# EAGLE design Spannungsversorgung (EAGLE 9.6.2)

## Sheet 1 of 3: In- & Outputs
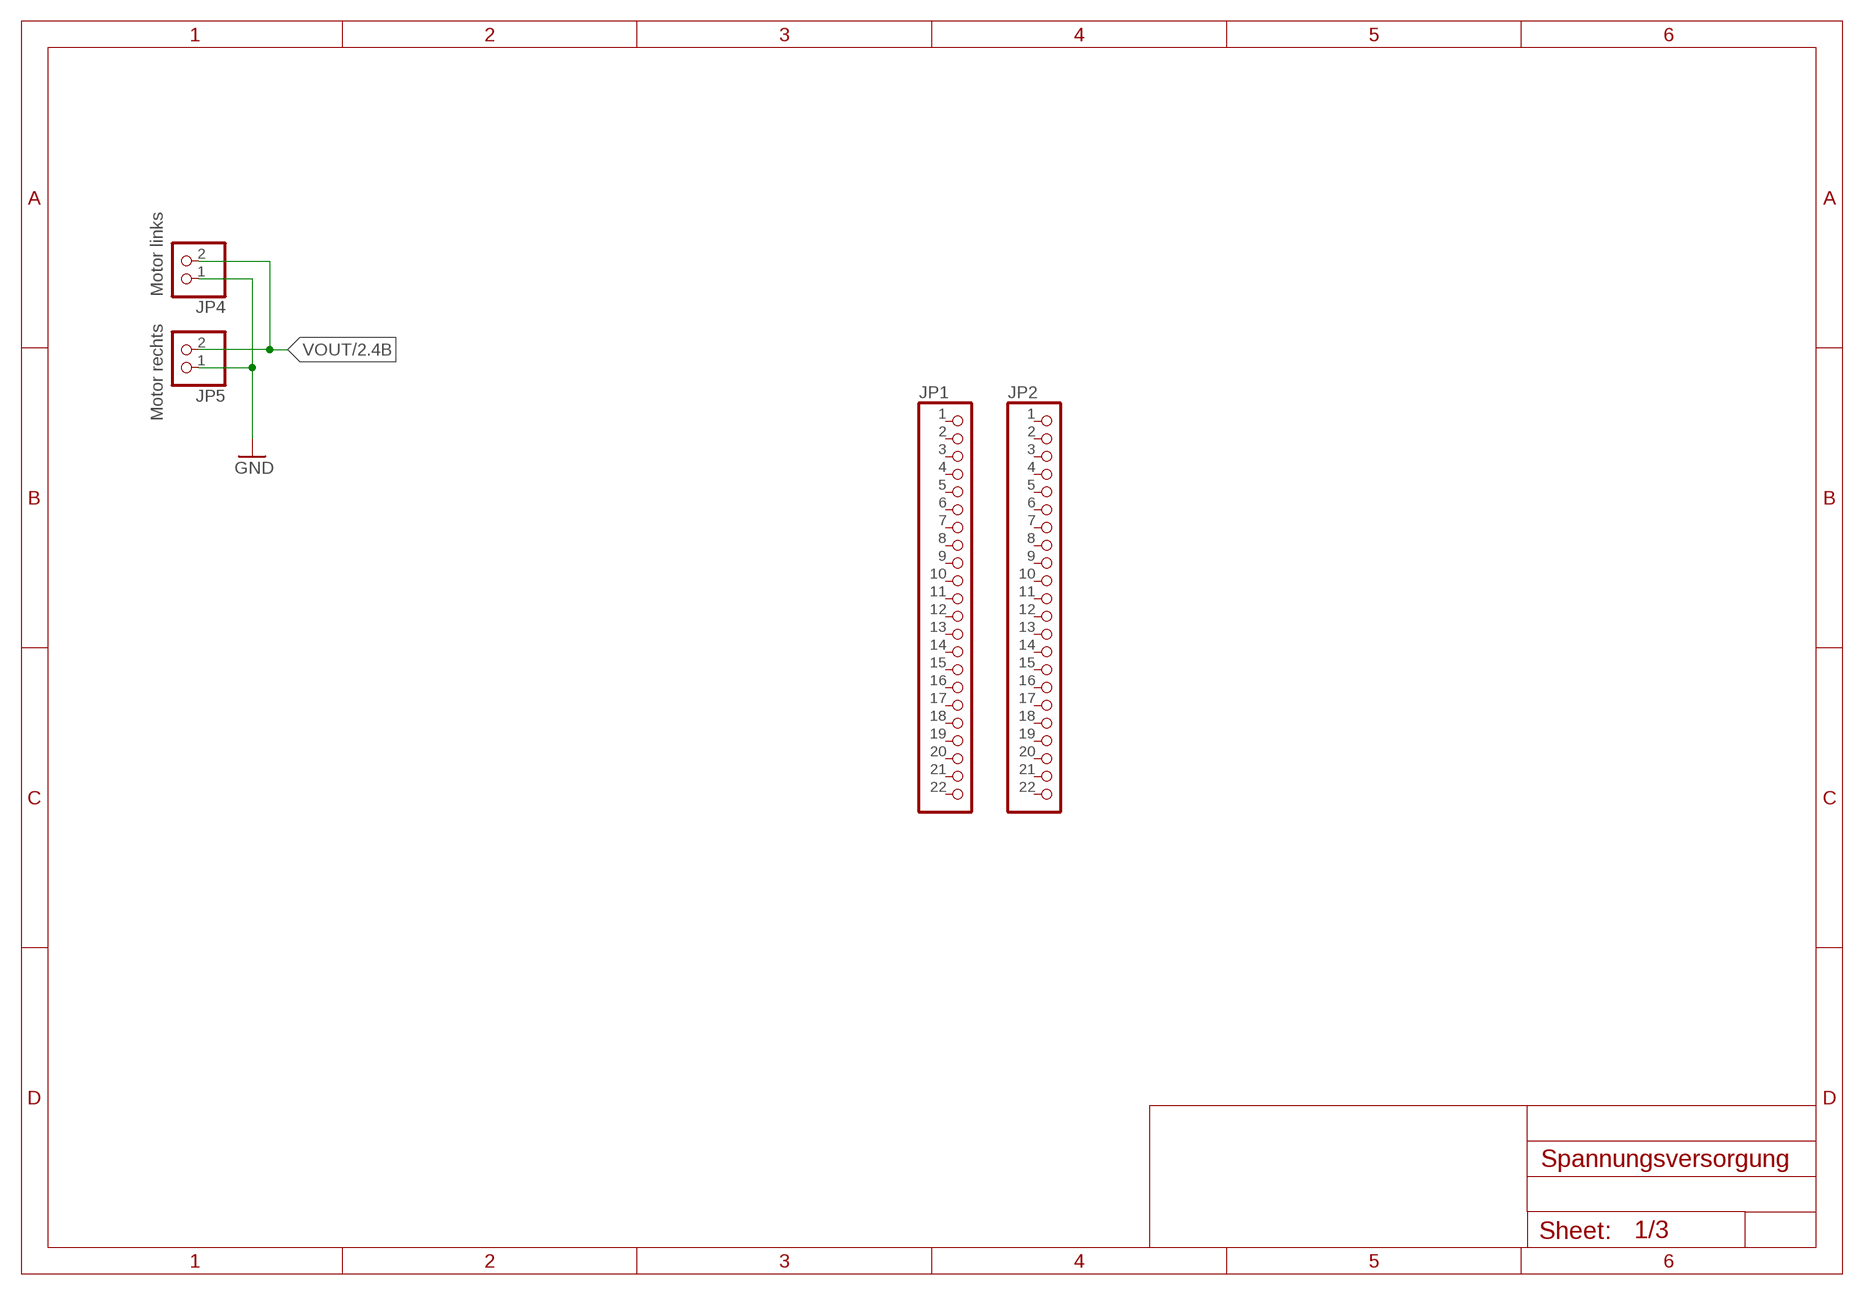
[diagram p0: schematic, sheet 1]

### Parts
JP1  PINHD-1X22  [1X22]
JP2  PINHD-1X22  [1X22]
JP4  PINHD-1X2  [1X02]
JP5  PINHD-1X2  [1X02]

### Nets
GND: JP4.1 JP5.1 ; also sheet 2
VOUT: JP4.2 JP5.2 ; also sheet 2
Unconnected: JP1.1 JP1.2 JP1.3 JP1.4 JP1.5 JP1.6 JP1.7 JP1.8 JP1.9 JP1.10 JP1.11 JP1.12 JP1.13 JP1.14 JP1.15 JP1.16 JP1.17 JP1.18 JP1.19 JP1.20 JP1.21 JP1.22 JP2.1 JP2.2 JP2.3 JP2.4 JP2.5 JP2.6 JP2.7 JP2.8 JP2.9 JP2.10 JP2.11 JP2.12 JP2.13 JP2.14 JP2.15 JP2.16 JP2.17 JP2.18 JP2.19 JP2.20 JP2.21 JP2.22

### Notes on the sheet
- Motor links
- Motor rechts

## Sheet 2 of 3: Spannungsregler
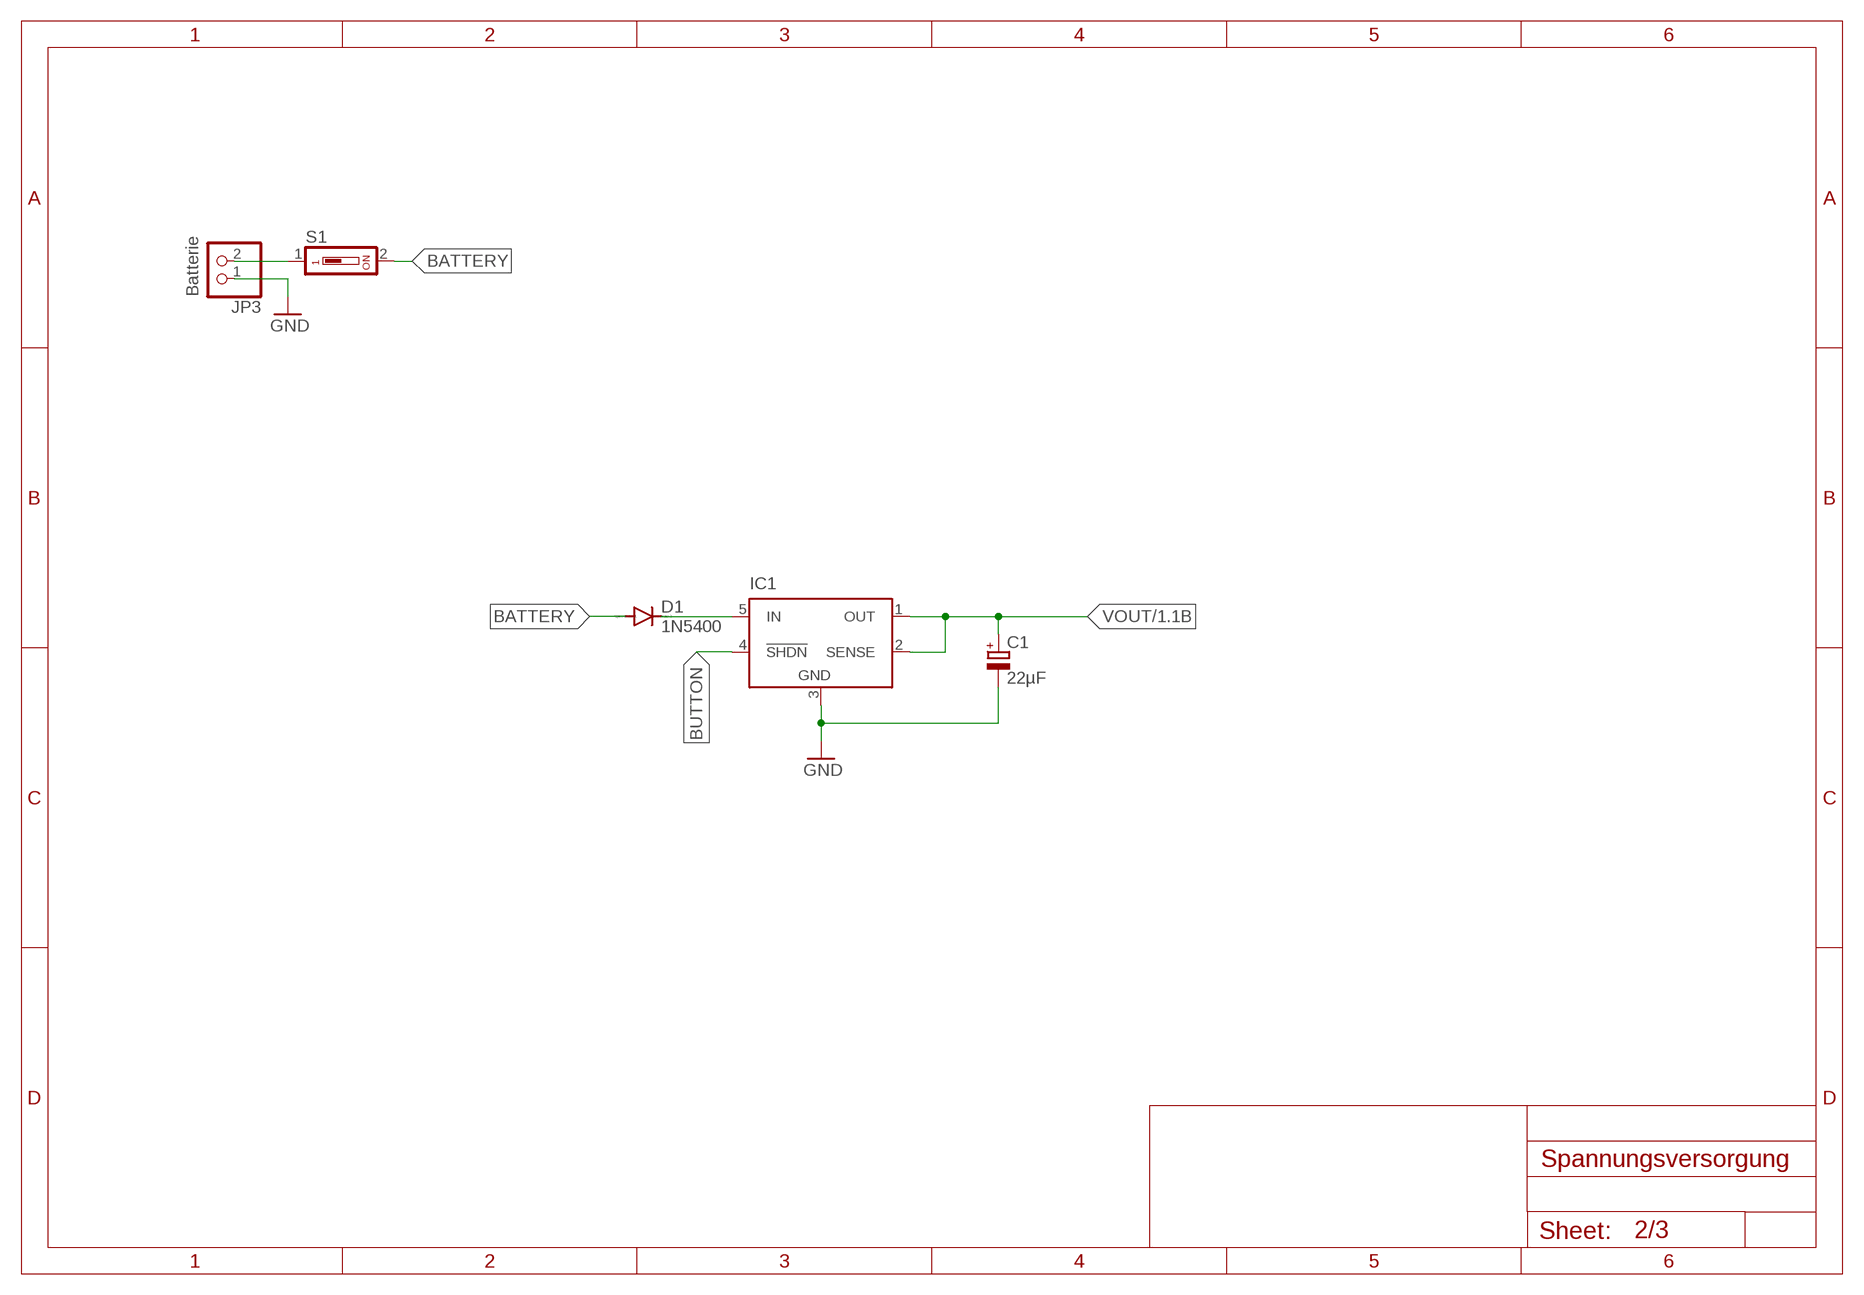
[diagram p1: schematic, sheet 2]

### Parts
C1  22µF  CPOL-EUE2.5-5  [E2,5-5]
D1  1N5400  [DO201-15]
IC1  LT1529T  [TO220-5]
JP3  PINHD-1X2  [1X02]
S1  DS01  [DS-01]

### Nets
BATTERY: D1.A JP3.2 S1.1 S1.2
BUTTON: IC1.4(!SHDN)
GND: C1.- IC1.3(GND) JP3.1 ; also sheet 1
N$2: D1.C IC1.5(IN)
VOUT: C1.+ IC1.1(OUT) IC1.2(SENSE) ; also sheet 1

### Notes on the sheet
- Batterie

## Sheet 3 of 3: Verschiedenes
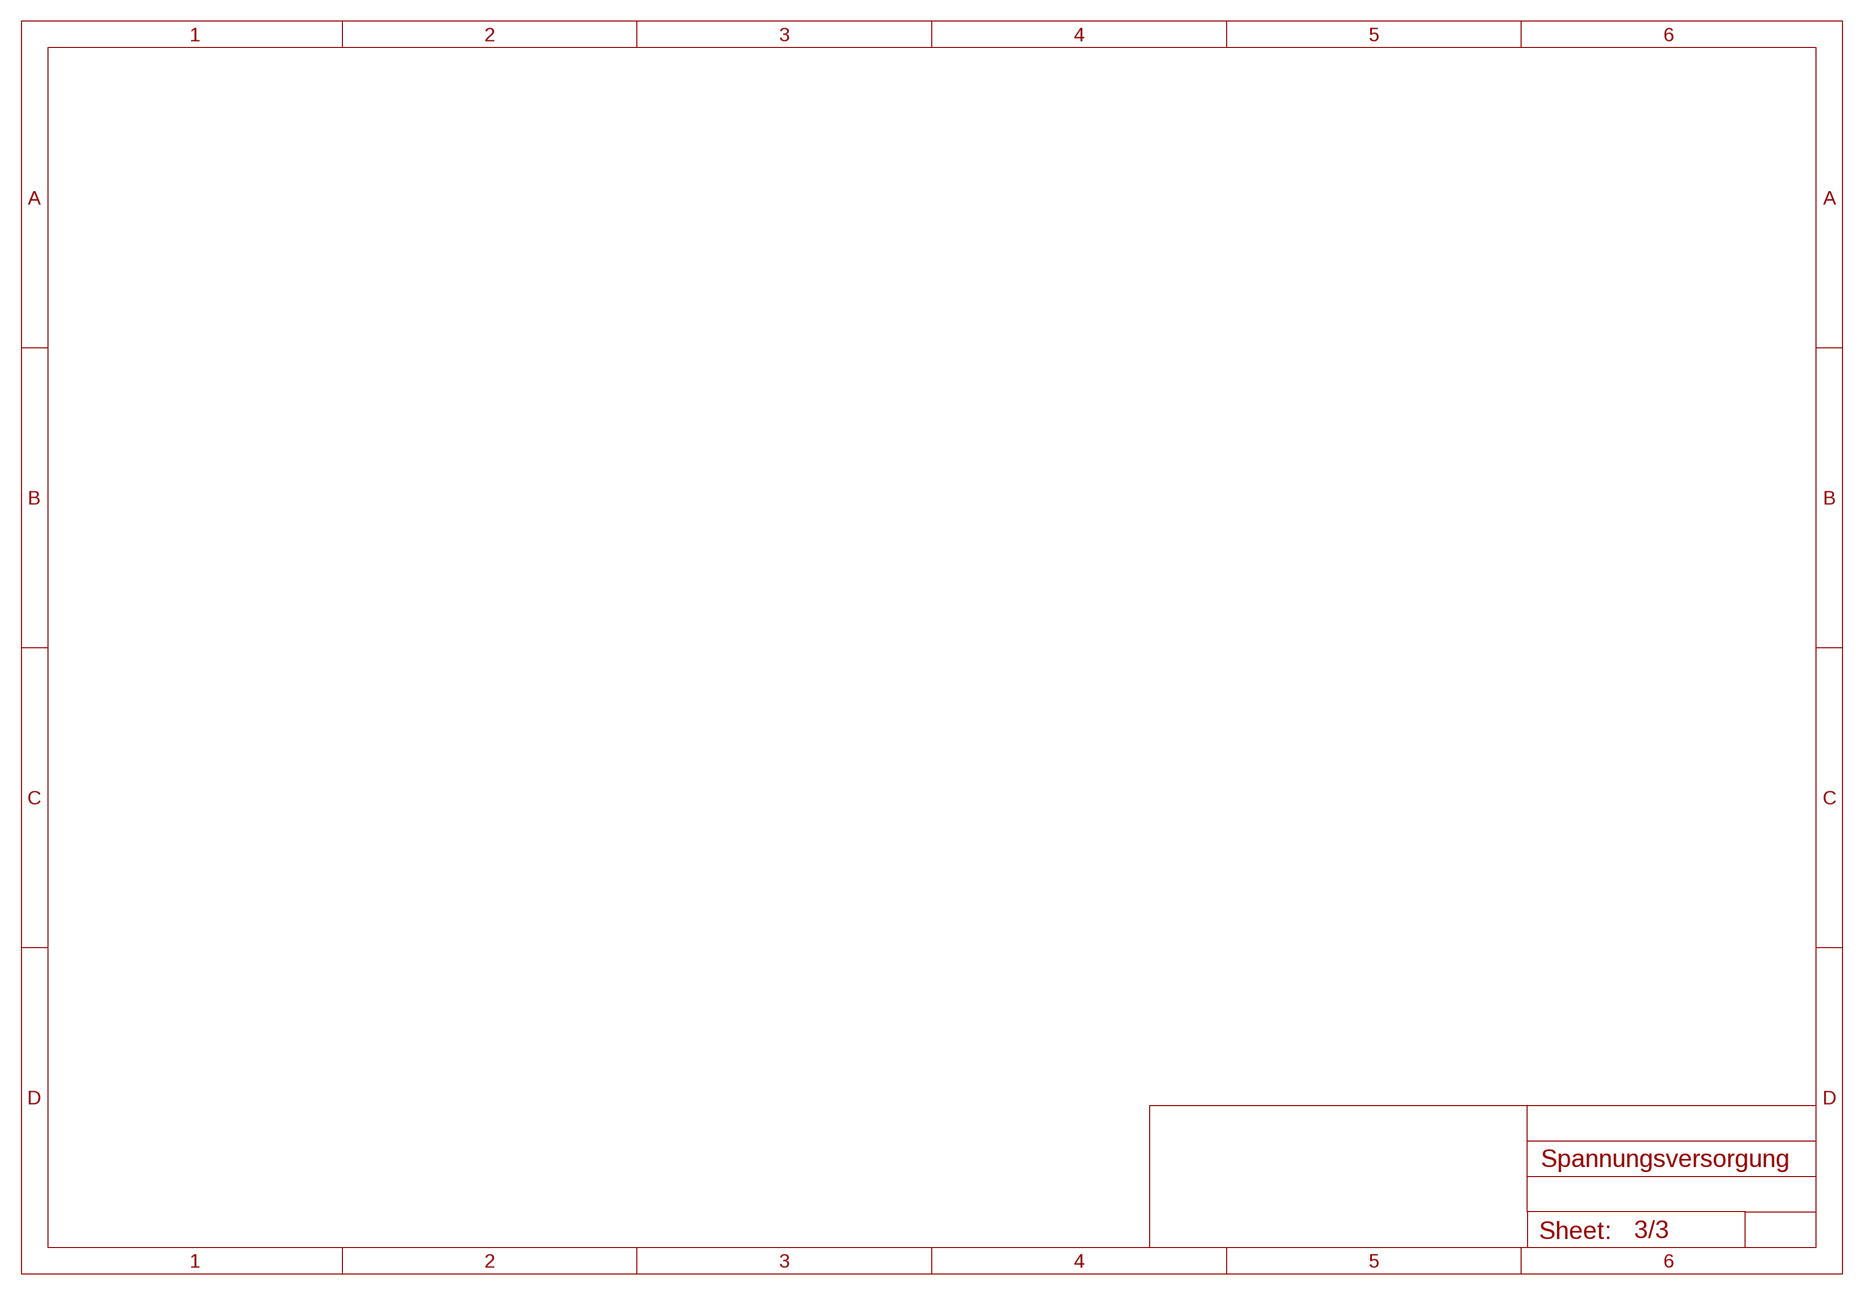
[diagram p2: schematic, sheet 3]

## Library data of the parts
C1 = rcl:CPOL-EU: POLARIZED CAPACITOR, European symbol; SPICEPREFIX: C
D1 = diode:1N5400: DIODE standard rectifier, 3 A, 50 V (Motorola)
IC1 = ltc1440_lt1529_ds1302:LT1529: LT1529 5 Volt LDO Regulator 5 Volt, 3 Ampere Low Dropout voltage regulator.
JP1 JP2 = pinhead:PINHD-1X22: PIN HEADER
JP3-JP5 = pinhead:PINHD-1X2: PIN HEADER
S1 = switch-dil:DS01: DIL/CODE SWITCH; OC_FARNELL: unknown; OC_NEWARK: unknown

## Board
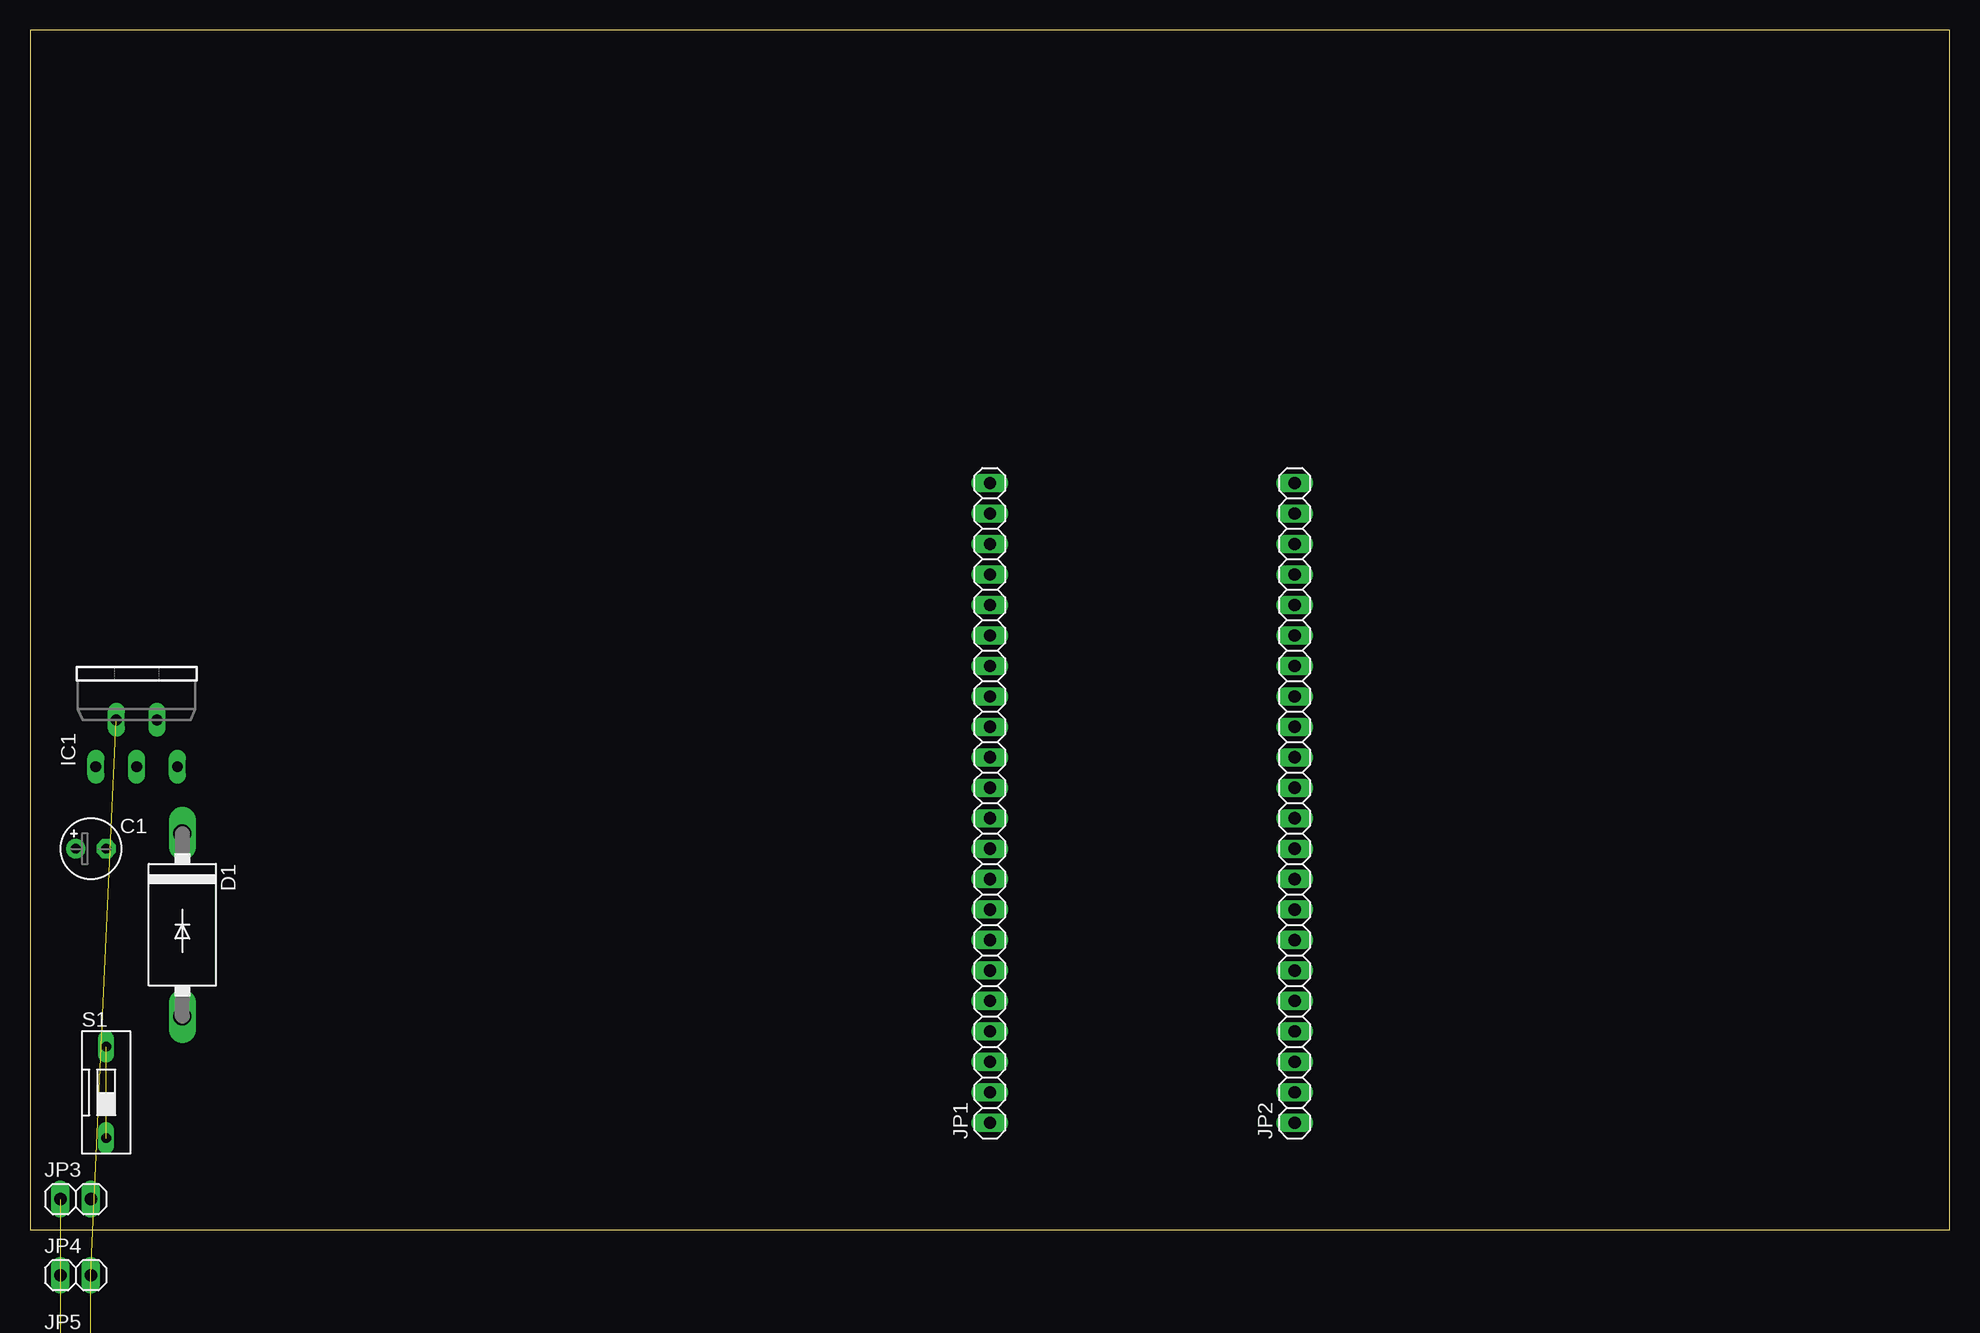
[diagram p3: board, top side]
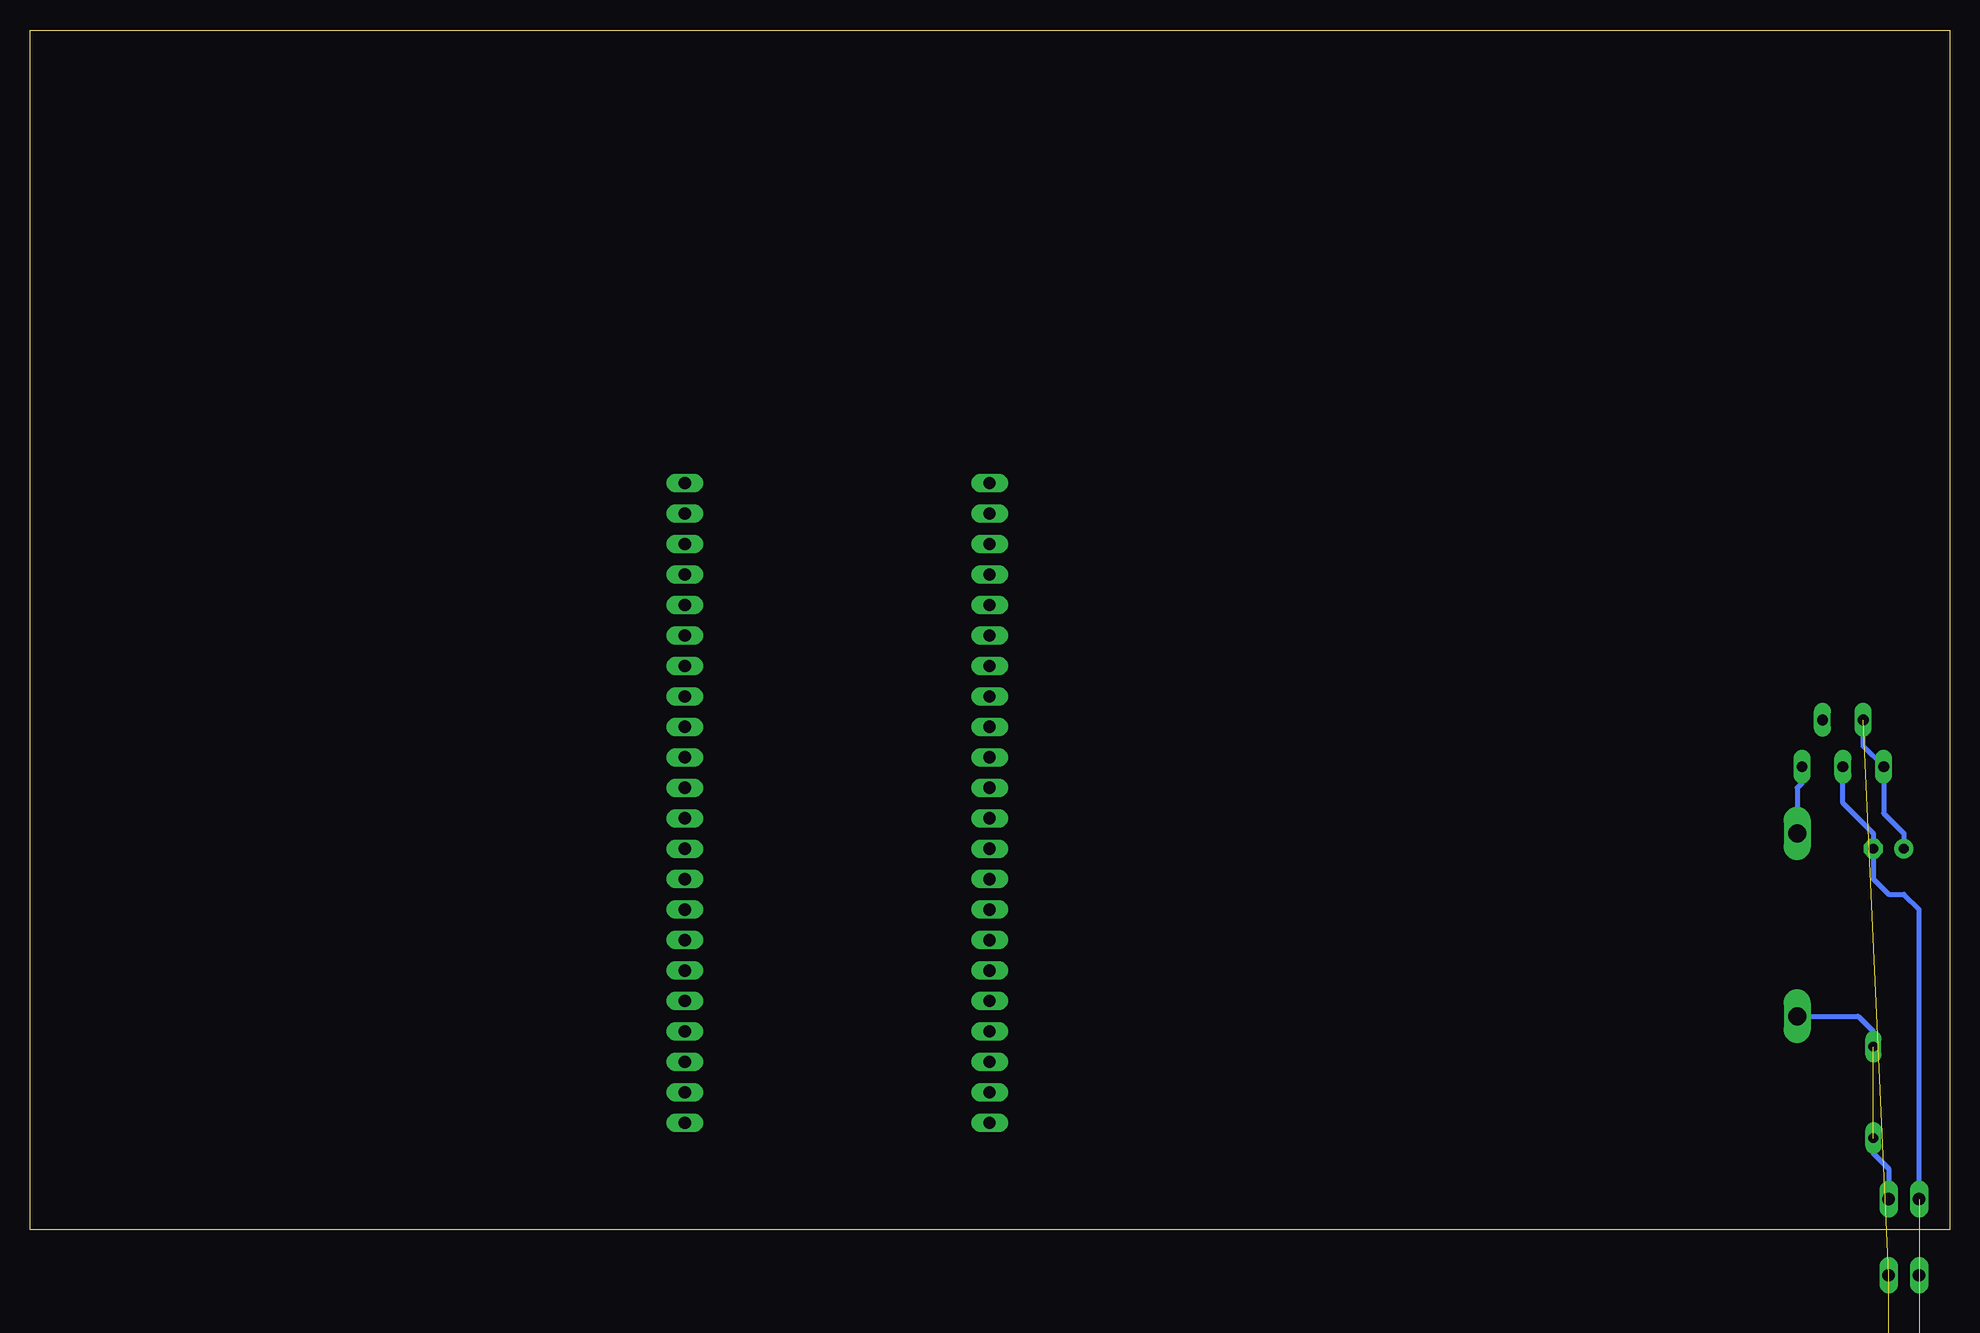
[diagram p4: board, bottom side, seen from below]

Size 160 x 100 mm. Coordinates in mm from the lower left corner, seen from the top.
Outline: 0,0 160,0 160,100 0,100 0,0
Copper layers (1*16): Top 0.035mm / dielectric 1.5mm / Bottom 0.035mm
Design rules "default": minimum track width 6mil, minimum drill 0.35mm, track to track 6mil, track to pad 6mil, pad to pad 6mil, via to via 6mil, smd to smd 6mil, copper to edge 40mil, drill to drill 6mil, minimum pad ring 10mil, minimum via ring 8mil, stop-mask expansion 4mil, vias tented up to drill 0mil, thermal gap 10mil

### Footprints (pad centres in the part's own frame; a part is rotated, then mirrored left to right if it is on the bottom)
E2,5-5 = drill 0.813 pad 1.6: + -1.27,0 | drill 0.813 pad 1.6 octagon: - 1.27,0
DO201-15 = drill 1.499 long: A 7.62,0; C -7.62,0
TO220-5 = drill 0.9 long: 1 -3.4,-8.4; 2 -1.7,-4.5; 3 0,-8.4; 4 1.7,-4.5; 5 3.4,-8.4
1X22 = drill 1.016 long: 1 -26.67,0; 2 -24.13,0; 3 -21.59,0; 4 -19.05,0; 5 -16.51,0; 6 -13.97,0; 7 -11.43,0; 8 -8.89,0; 9 -6.35,0; 10 -3.81,0; 11 -1.27,0; 12 1.27,0; 13 3.81,0; 14 6.35,0; 15 8.89,0; 16 11.43,0; 17 13.97,0; 18 16.51,0; 19 19.05,0; 20 21.59,0; 21 24.13,0; 22 26.67,0
1X02 = drill 1.016 long: 1 -1.27,0; 2 1.27,0
DS-01 = drill 0.813 long: 1 0,-3.81; 2 0,3.81

### Placement (x,y rotation side)
C1  5.08,31.75 0 top
D1  12.7,25.4 270 top
IC1  8.89,46.99 0 top
JP1  80.01,35.56 90 top
JP2  105.41,35.56 90 top
JP3  3.81,2.54 0 top
JP4  3.81,-3.81 0 top  (outside the outline)
JP5  3.81,-10.16 0 top  (outside the outline)
S1  6.35,11.43 0 top

### Tracks (layer width: path | path; a pad name or v marks a point on that pad's centre or on a via)
BATTERY  (1 unrouted)
  Bottom 0.406: S1.1 6.35,6.35 5.08,5.08 JP3.2 | D1.A 7.62,17.78 6.35,16.51 S1.2
GND  (2 unrouted)
  Bottom 0.406: IC1.3 8.89,35.56 6.35,33.02 C1.- 6.35,29.21 5.08,27.94 3.81,27.94 2.54,26.67 JP3.1
N$2
  Bottom 0.406: IC1.5 12.29,37.24 12.7,36.83 D1.C
VOUT  (2 unrouted)
  Bottom 0.406: C1.+ 3.81,33.02 5.49,34.7 IC1.1 7.19,40.29 IC1.2

### Text on the board
Reference: 1000mil